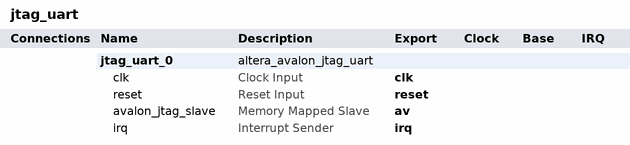
[diagram p0: system contents]
# Platform Designer (Qsys) system jtag_uart, MAX 10 10M50DAF484C6GES
# Parameters at their usual value, and those the tool derives, are not listed.
package require -exact qsys 20.1
create_system jtag_uart
set_project_property DEVICE_FAMILY {MAX 10}
set_project_property DEVICE 10M50DAF484C6GES

add_instance jtag_uart_0 altera_avalon_jtag_uart 20.1
set_instance_parameter_value jtag_uart_0 simInteractiveOptions NO_INTERACTIVE_WINDOWS
set_instance_parameter_value jtag_uart_0 writeBufferDepth 256

# exported interfaces
add_interface av avalon slave
set_interface_property av EXPORT_OF jtag_uart_0.avalon_jtag_slave
add_interface clk clock sink
set_interface_property clk EXPORT_OF jtag_uart_0.clk
add_interface irq interrupt sender
set_interface_property irq EXPORT_OF jtag_uart_0.irq
add_interface reset reset sink
set_interface_property reset EXPORT_OF jtag_uart_0.reset

set_interconnect_requirement {$system} qsys_mm.clockCrossingAdapter HANDSHAKE
set_interconnect_requirement {$system} qsys_mm.enableEccProtection FALSE
set_interconnect_requirement {$system} qsys_mm.insertDefaultSlave FALSE
set_interconnect_requirement {$system} qsys_mm.maxAdditionalLatency 1

save_system jtag_uart.qsys
